# EAGLE schematic 5v-oscillator (EAGLE 5.07)
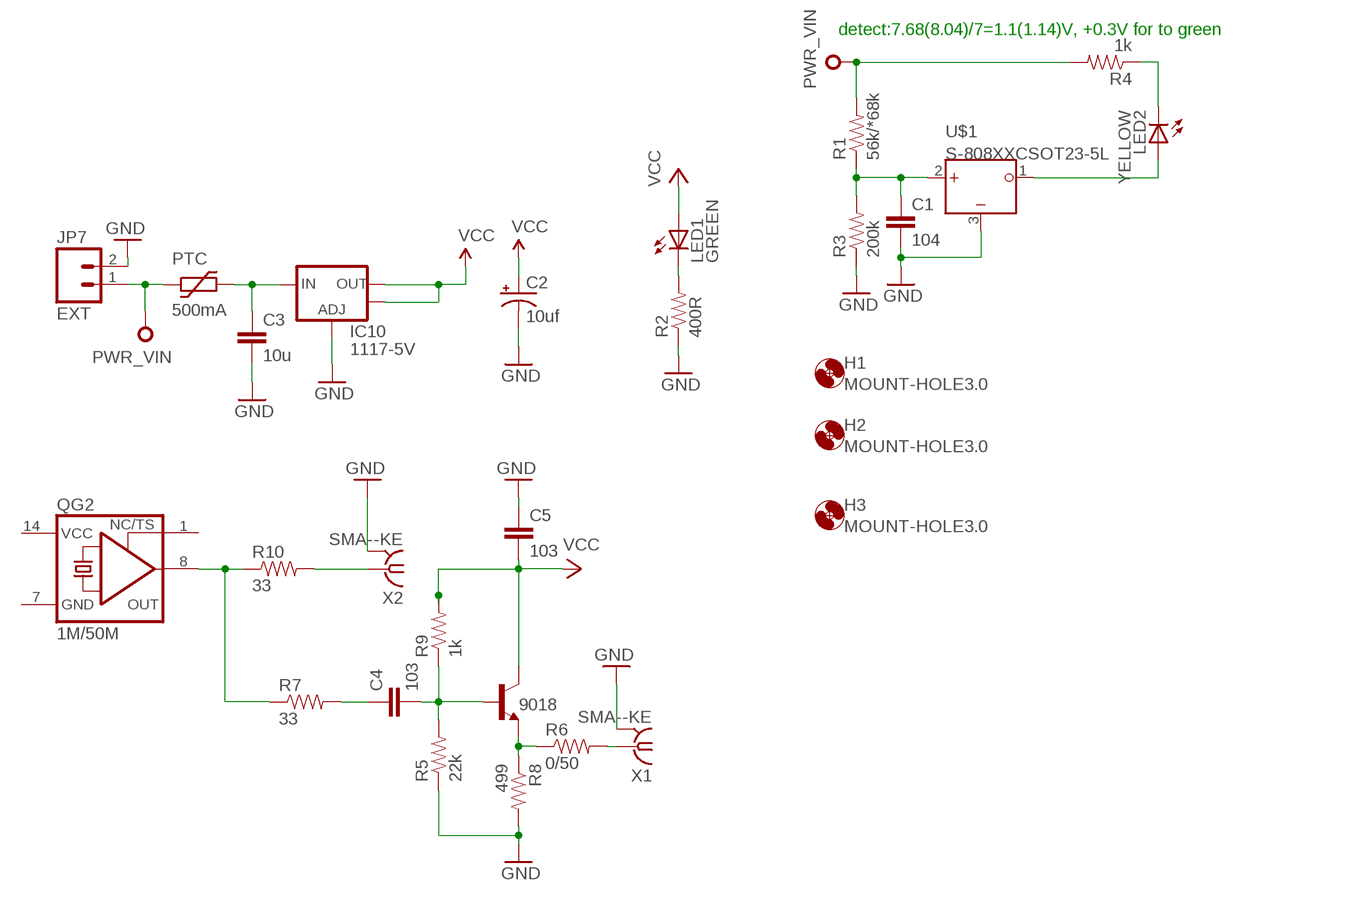
[diagram p0: schematic, sheet 1]

## Parts
9018  -NPN-SOT23-BEC  [SOT23-BEC]
C1  104  CAP-C0805K  [C0805K]
C2  10uf  CAP_POL3528  [EIA3528]
C3  10u  CAP-C1206  [C1206]
C4  103  CAP-C0805  [C0805]
C5  103  CAP-C0805  [C0805]
H1  MOUNT-HOLE3.0  [3,0]
H2  MOUNT-HOLE3.0  [3,0]
H3  MOUNT-HOLE3.0  [3,0]
IC10  1117-5V  V_REG_LM1117SOT223  [SOT223]
JP7  EXT  CON-02-XH  [XH-1X2-LONG-LOCK]
LED1  GREEN  LED3MM  [LED3MM]
LED2  YELLOW  LED3MM  [LED3MM]
PTC  500mA  PTC-FUSE1812L  [1812L]
QG2  1M/50M  XO-14  [DIL14S]
R1  56k/*68k  RESISTOR0805  [0805]
R2  400R  RESISTOR0805  [0805]
R3  200k  RESISTOR0805  [0805]
R4  1k  RESISTOR0805  [0805]
R5  22k  RESISTOR0805  [0805]
R6  0/50  RESISTOR0805  [0805]
R7  33  RESISTOR0805  [0805]
R8  499  RESISTOR-R0805W  [R0805W]
R9  1k  RESISTOR0805  [0805]
R10  33  RESISTOR0805  [0805]
U$1  S-808XXCSOT23-5L  [SOT23-5L]
X1  SMA--KE  [SMA-KE]
X2  SMA--KE  [SMA-KE]

## Nets
CLK-REF: QG2.8(OUT) R7.1 R10.1
GND: C1.2 C2.C(-) C3.2 C5.1 IC10.1(ADJ) JP7.2 R2.1 R3.1 R5.1 R8.2 U$1.3(VSS) X1.G@1(GND) X2.G@1(GND)
N$1: C1.1 R1.1 R3.2 U$1.2(VDD)
N$2: C4.1 R7.2
N$3: LED2.K(C) R4.1
N$4: R6.2 X1.1
N$5: LED2.A U$1.1(OUT)
N$6: 9018.E R6.1 R8.1
N$7: 9018.B C4.2 R5.2 R9.1
N$14: C3.1 IC10.3(IN) PTC.P$2
N$19: R10.2 X2.1
N$32: LED1.K(C) R2.2
PWR_VIN: JP7.1 PTC.P$1 R1.2 R4.2
VCC: 9018.C C2.A(+) C5.2 IC10.2(OUT) IC10.4(OUT) LED1.A R9.2
Unconnected: QG2.1(TS)

## Notes on the sheet
- detect:7.68(8.04)/7=1.1(1.14)V, +0.3V for to green

## Power pins joined to a net without a drawn wire
GND: QG2.7(GND) X1.G@2(GND) X1.G@3(GND) X1.G@4(GND) X2.G@2(GND) X2.G@3(GND) X2.G@4(GND)
VCC: QG2.14(VCC)

## Library data of the parts
9018 = digital-toy:*-NPN-: NPN Transistror most of sot-23 use the pacages sot23-BEC, top C, left B, right E. by hyl, digital-toy. and to-92 use ebc(from-top) by hyl, digital-toy.
C1 C3-C5 = digital-toy:CAP: Capacitor Standard 0603 ceramic capacitor, and 0.1" leaded capacitor.
C2 = digital-toy:CAP_POL: Capacitor Polarized These are standard SMD and PTH capacitors. Normally 10uF, 47uF, and 100uF in electrolytic and tantalum varieties. Always verify the external diameter of the through hole cap, it varies with capacity, voltage, and manufacturer. The EIA devices should be standard. PANASONIC_D size: 6.5mmx6.5mmx5.5mm, 100uf (taobao:6.3mmx5.5mm), same as CVL0605 153cvl0405 size: 4mmx4mmx5.5mm, 10uf (taobao:4mmx5.5mm) ct6032 typical 47uF Tantalum, comment by hyl.
H1-H3 = holes:MOUNT-HOLE: MOUNTING HOLE with drill center marker
IC10 = SparkFun:V_REG_LM1117: Voltage Regulator LM1117 Standard adjustable voltage regulator but in SMD form. Spark Fun Electronics SKU : COM-00595
JP7 = digital-toy:CON-02: Header 2 Standard 2-pin 0.1" header. Use with straight break away headers (SKU : PRT-00116), right angle break away headers (PRT-00553), swiss pins (PRT-00743), machine pins (PRT-00117), and female headers (PRT-00115). Molex polarized connector foot print use with SKU : PRT-08233 with associated crimp pins and housings.
LED1 LED2 = digital-toy:LED: LEDs Standard schematic elements and footprints for 5mm, 3mm, 1206, and 0603 sized LEDs. 5mm - Spark Fun Electronics SKU : COM-00529 (and others) copy led.lbr 0805 led here, by hyl digital-toy. 2010.6.29
PTC = digital-toy:PTC-FUSE
QG2 = digital-toy:XO-: CRYSTAL
R1-R10 = digital-toy:RESISTOR: Resistor Basic schematic elements and footprints for 0603, 1206, and PTH 1/10th watt (small) resistors. digital-toy copy vertical mount of axial-0.3 from rcl.lbr : the 0207/xx
U$1 = digital-toy:S-808XXC: S-808XXC Seiko Instruments. power voltage detector. S-80860CNNB-B9L-T2: 6.0V, N-Jfet output, SC-82AB packages. digital-toy, hyl, 2011/5/19
X1 X2 = dtoy-RF:SMA-: SMA 50 Ohm End Launch Jack Receptacle - Round Contact Johnson Components Source: www.johnsoncomponents.com .. J502-ND.pdf